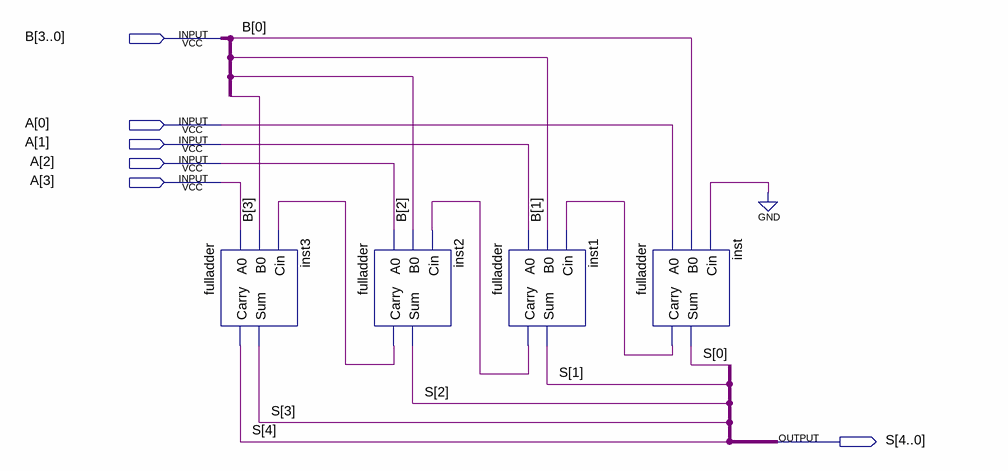
[diagram p0: schematic sheet]
// Quartus schematic fa4.bdf as structural Verilog: 4 symbols, 6 pins
module fa4 (
  input  [3:0] B,
  input  [3:0] A,
  output [4:0] S
);

  wire inst1_carry, inst2_carry, inst_carry;

  fulladder inst3 (.A0(A[3]), .B0(B[3]), .Cin(inst2_carry), .Carry(S[4]), .Sum(S[3]));
  fulladder inst2 (.A0(A[2]), .B0(B[2]), .Cin(inst1_carry), .Carry(inst2_carry), .Sum(S[2]));
  fulladder inst1 (.A0(A[1]), .B0(B[1]), .Cin(inst_carry), .Carry(inst1_carry), .Sum(S[1]));
  fulladder inst (.A0(A[0]), .B0(B[0]), .Cin(1'b0), .Carry(inst_carry), .Sum(S[0]));
endmodule
